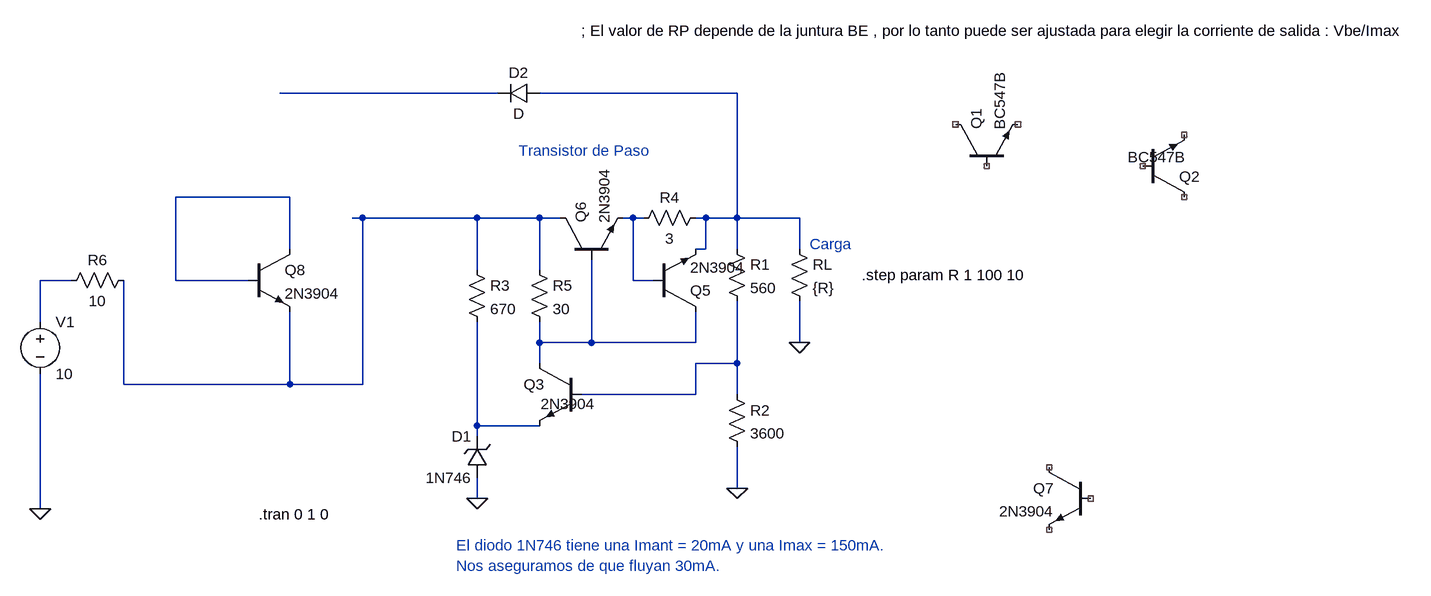
[diagram p0: schematic FuenteMartin.asc]
FuenteMartin.asc, the LTspice schematic file:
Version 4
SHEET 1 1496 680
WIRE -16 -240 -352 -240
WIRE 352 -240 48 -240
WIRE -336 -80 -512 -80
WIRE -224 -48 -240 -48
WIRE -48 -48 -224 -48
WIRE 48 -48 -48 -48
WIRE 80 -48 48 -48
WIRE 192 -48 176 -48
WIRE 208 -48 192 -48
WIRE 304 -48 288 -48
WIRE 352 -48 352 -240
WIRE 352 -48 304 -48
WIRE 448 -48 352 -48
WIRE -336 0 -336 -80
WIRE 304 0 304 -48
WIRE 304 0 288 0
WIRE 352 0 352 -48
WIRE 448 0 448 -48
WIRE -48 32 -48 -48
WIRE 48 32 48 -48
WIRE -672 48 -720 48
WIRE -512 48 -512 -80
WIRE -400 48 -512 48
WIRE 192 48 192 -48
WIRE 224 48 192 48
WIRE -720 112 -720 48
WIRE 48 144 48 112
WIRE 128 144 128 16
WIRE 128 144 48 144
WIRE 288 144 288 96
WIRE 288 144 128 144
WIRE 448 144 448 80
WIRE 48 176 48 144
WIRE 352 176 352 80
WIRE 352 176 288 176
WIRE -592 208 -592 48
WIRE -336 208 -336 96
WIRE -336 208 -592 208
WIRE -224 208 -224 -48
WIRE -224 208 -336 208
WIRE 288 224 288 176
WIRE 288 224 112 224
WIRE 352 224 352 176
WIRE -48 272 -48 112
WIRE 48 272 -48 272
WIRE -48 288 -48 272
WIRE 352 368 352 304
WIRE -48 384 -48 352
WIRE -720 400 -720 192
FLAG -720 400 0
FLAG -48 384 0
FLAG 352 368 0
FLAG 448 144 0
DATAFLAG 432 -48 ""
DATAFLAG -80 -48 ""
SYMBOL npn 688 -128 R270
SYMATTR InstName Q1
SYMATTR Value BC547B
SYMBOL res 336 -16 R0
SYMATTR InstName R1
SYMATTR Value 560
SYMBOL res 336 208 R0
SYMATTR InstName R2
SYMATTR Value 3600
SYMBOL res -64 16 R0
SYMATTR InstName R3
SYMATTR Value 670
SYMBOL voltage -720 96 R0
WINDOW 123 0 0 Left 0
WINDOW 39 0 0 Left 0
SYMATTR InstName V1
SYMATTR Value 10
SYMBOL res 432 -16 R0
SYMATTR InstName RL
SYMATTR Value {R}
SYMBOL npn 976 -80 M180
WINDOW 3 -23 62 Left 2
SYMATTR Value BC547B
SYMATTR InstName Q2
SYMBOL res 304 -64 R90
WINDOW 0 0 56 VBottom 2
WINDOW 3 32 56 VTop 2
SYMATTR InstName R4
SYMATTR Value 3
SYMBOL npn 112 176 M0
WINDOW 3 -23 62 Left 2
SYMATTR Value 2N3904
SYMATTR InstName Q3
SYMBOL res 32 16 R0
SYMATTR InstName R5
SYMATTR Value 30
SYMBOL res -576 32 R90
WINDOW 0 0 56 VBottom 2
WINDOW 3 32 56 VTop 2
SYMATTR InstName R6
SYMATTR Value 10
SYMBOL zener -32 352 R180
WINDOW 0 24 64 Left 2
WINDOW 3 24 0 Left 2
SYMATTR InstName D1
SYMATTR Value 1N746
SYMBOL diode 48 -256 R90
WINDOW 0 0 32 VBottom 2
WINDOW 3 32 32 VTop 2
SYMATTR InstName D2
SYMBOL npn 224 96 M180
SYMATTR InstName Q5
SYMATTR Value 2N3904
SYMBOL npn 80 16 R270
SYMATTR InstName Q6
SYMATTR Value 2N3904
SYMBOL npn 896 336 M0
SYMATTR InstName Q7
SYMATTR Value 2N3904
SYMBOL npn -400 0 R0
SYMATTR InstName Q8
SYMATTR Value 2N3904
TEXT -384 408 Left 2 !.tran 0 1 0
TEXT 112 -336 Left 2 !; El valor de RP depende de la juntura BE , por lo tanto puede ser ajustada para elegir la corriente de salida : Vbe/Imax
TEXT -80 456 Left 2 ;El diodo 1N746 tiene una Imant = 20mA y una Imax = 150mA.\nNos aseguramos de que fluyan 30mA.
TEXT 464 -8 Left 2 ;Carga
TEXT 16 -152 Left 2 ;Transistor de Paso
TEXT 544 40 Left 2 !.step param R 1 100 10

The netlist it stands for:
* FuenteMartin.asc
Q1 NC_01 NC_02 NC_03 0 BC547B
R1 N002 N008 560
R2 N008 0 3600
R3 N004 N009 670
V1 N006 0 10
RL N002 0 {R}
Q2 NC_04 NC_05 NC_06 0 BC547B
R4 N002 N005 3
Q3 N007 N008 N009 0 2N3904
R5 N004 N007 30
R6 N004 N006 10
D1 0 N009 1N746
D2 N002 N001 D
Q5 N007 N005 N002 0 2N3904
Q6 N004 N007 N005 0 2N3904
Q7 NC_07 NC_08 NC_09 0 2N3904
Q8 N003 N003 N004 0 2N3904
.model D D
.lib standard.dio
.model NPN NPN
.model PNP PNP
.lib standard.bjt
.tran 0 1 0
; El valor de RP depende de la juntura BE , por lo tanto puede ser ajustada para elegir la corriente de salida : Vbe/Imax
* El diodo 1N746 tiene una Imant = 20mA y una Imax = 150mA.
* Nos aseguramos de que fluyan 30mA.
* Carga
* Transistor de Paso
.step param R 1 100 10
.backanno
.end